# Altium schematic sheet heath_monitor.SchDoc
size A
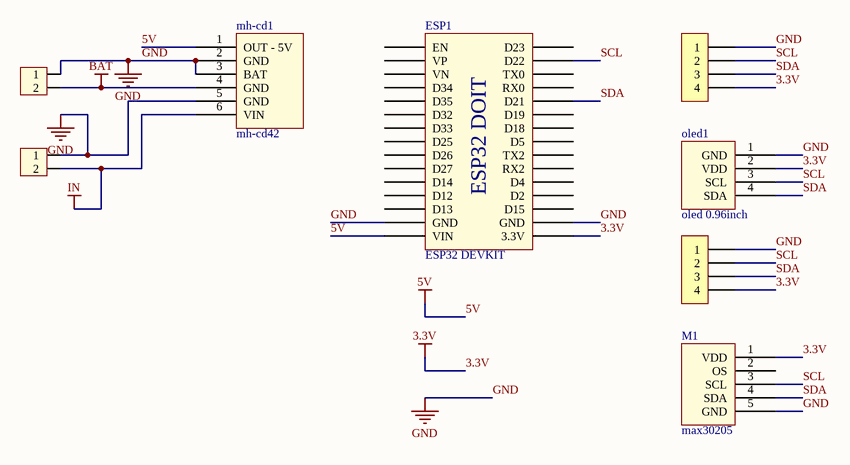
[diagram p0: heath_monitor.SchDoc]

## Parts
ESP1  ESP32 DEVKIT  [ESP32 WROOM 32 KIT]
H1  (no value)  [Header 4P DC 2.54]
h2  (no value)  [Header 4P DC 2.54]
M1  max30205  [max30205]
mh-cd1  mh-cd42  [mh-cd42]
Nguon_sac  (no value)  [XH2.54M-2]
oled1  oled 0.96inch  [oled 0x96inch]
PIN  (no value)  [XH2.54M-2]

## Nets
3.3V: ESP1.16(3.3V) H1.4 h2.4 M1.1(VDD) oled1.2(VDD)
5V: ESP1.15(VIN) mh-cd1.1(OUT_-_5V)
BAT: mh-cd1.4(GND) PIN.2
GND: ESP1.14(GND) ESP1.17(GND) H1.1 h2.1 M1.5(GND) mh-cd1.2(GND) mh-cd1.3(BAT) mh-cd1.5(GND) Nguon_sac.1 oled1.1(GND) PIN.1
IN: mh-cd1.6(VIN) Nguon_sac.2
SCL: ESP1.29(D22) H1.2 h2.2 M1.3(SCL) oled1.3(SCL)
SDA: ESP1.26(D21) H1.3 h2.3 M1.4(SDA) oled1.4(SDA)

Not connected (* = marked no-connect by the designer): ESP1 1(EN) 2(VP) 3(VN) 4(D34) 5(D35) 6(D32) 7(D33) 8(D25) 9(D26) 10(D27) 11(D14) 12(D12) 13(D13) 18(D15) 19(D2) 20(D4) 21(RX2) 22(TX2) 23(D5) 24(D18) 25(D19) 27(RX0) 28(TX0) 30(D23); M1 2(OS)

## Notes on the sheet
- (in symbol ESP32 WROOM 32 KIT) ESP32 DOIT

## Library data of the parts
ESP1 = ESP32 WROOM 32 KIT
H1 h2 = Header 4P 2.54 Duc Cong: Cắm; Ten_Linh_Kien: Header 4P XH2.54-4P Đực Cong; Don_Vi: Con; Ma_Hang: MH001310; Chung_Loai: Cắm
M1 = max30205: Mã hàng: AM-057; Giá: 178.000
Nguon_sac PIN = Header 2P 2.54 Duc Thang: Cắm; Ten_Linh_Kien: Header 2P XH2.54-2P Đực Thẳng; Don_Vi: Con; Ma_Hang: MH001283; Chung_Loai: Cắm